# Altium schematic sheet DDR3.SchDoc
size C
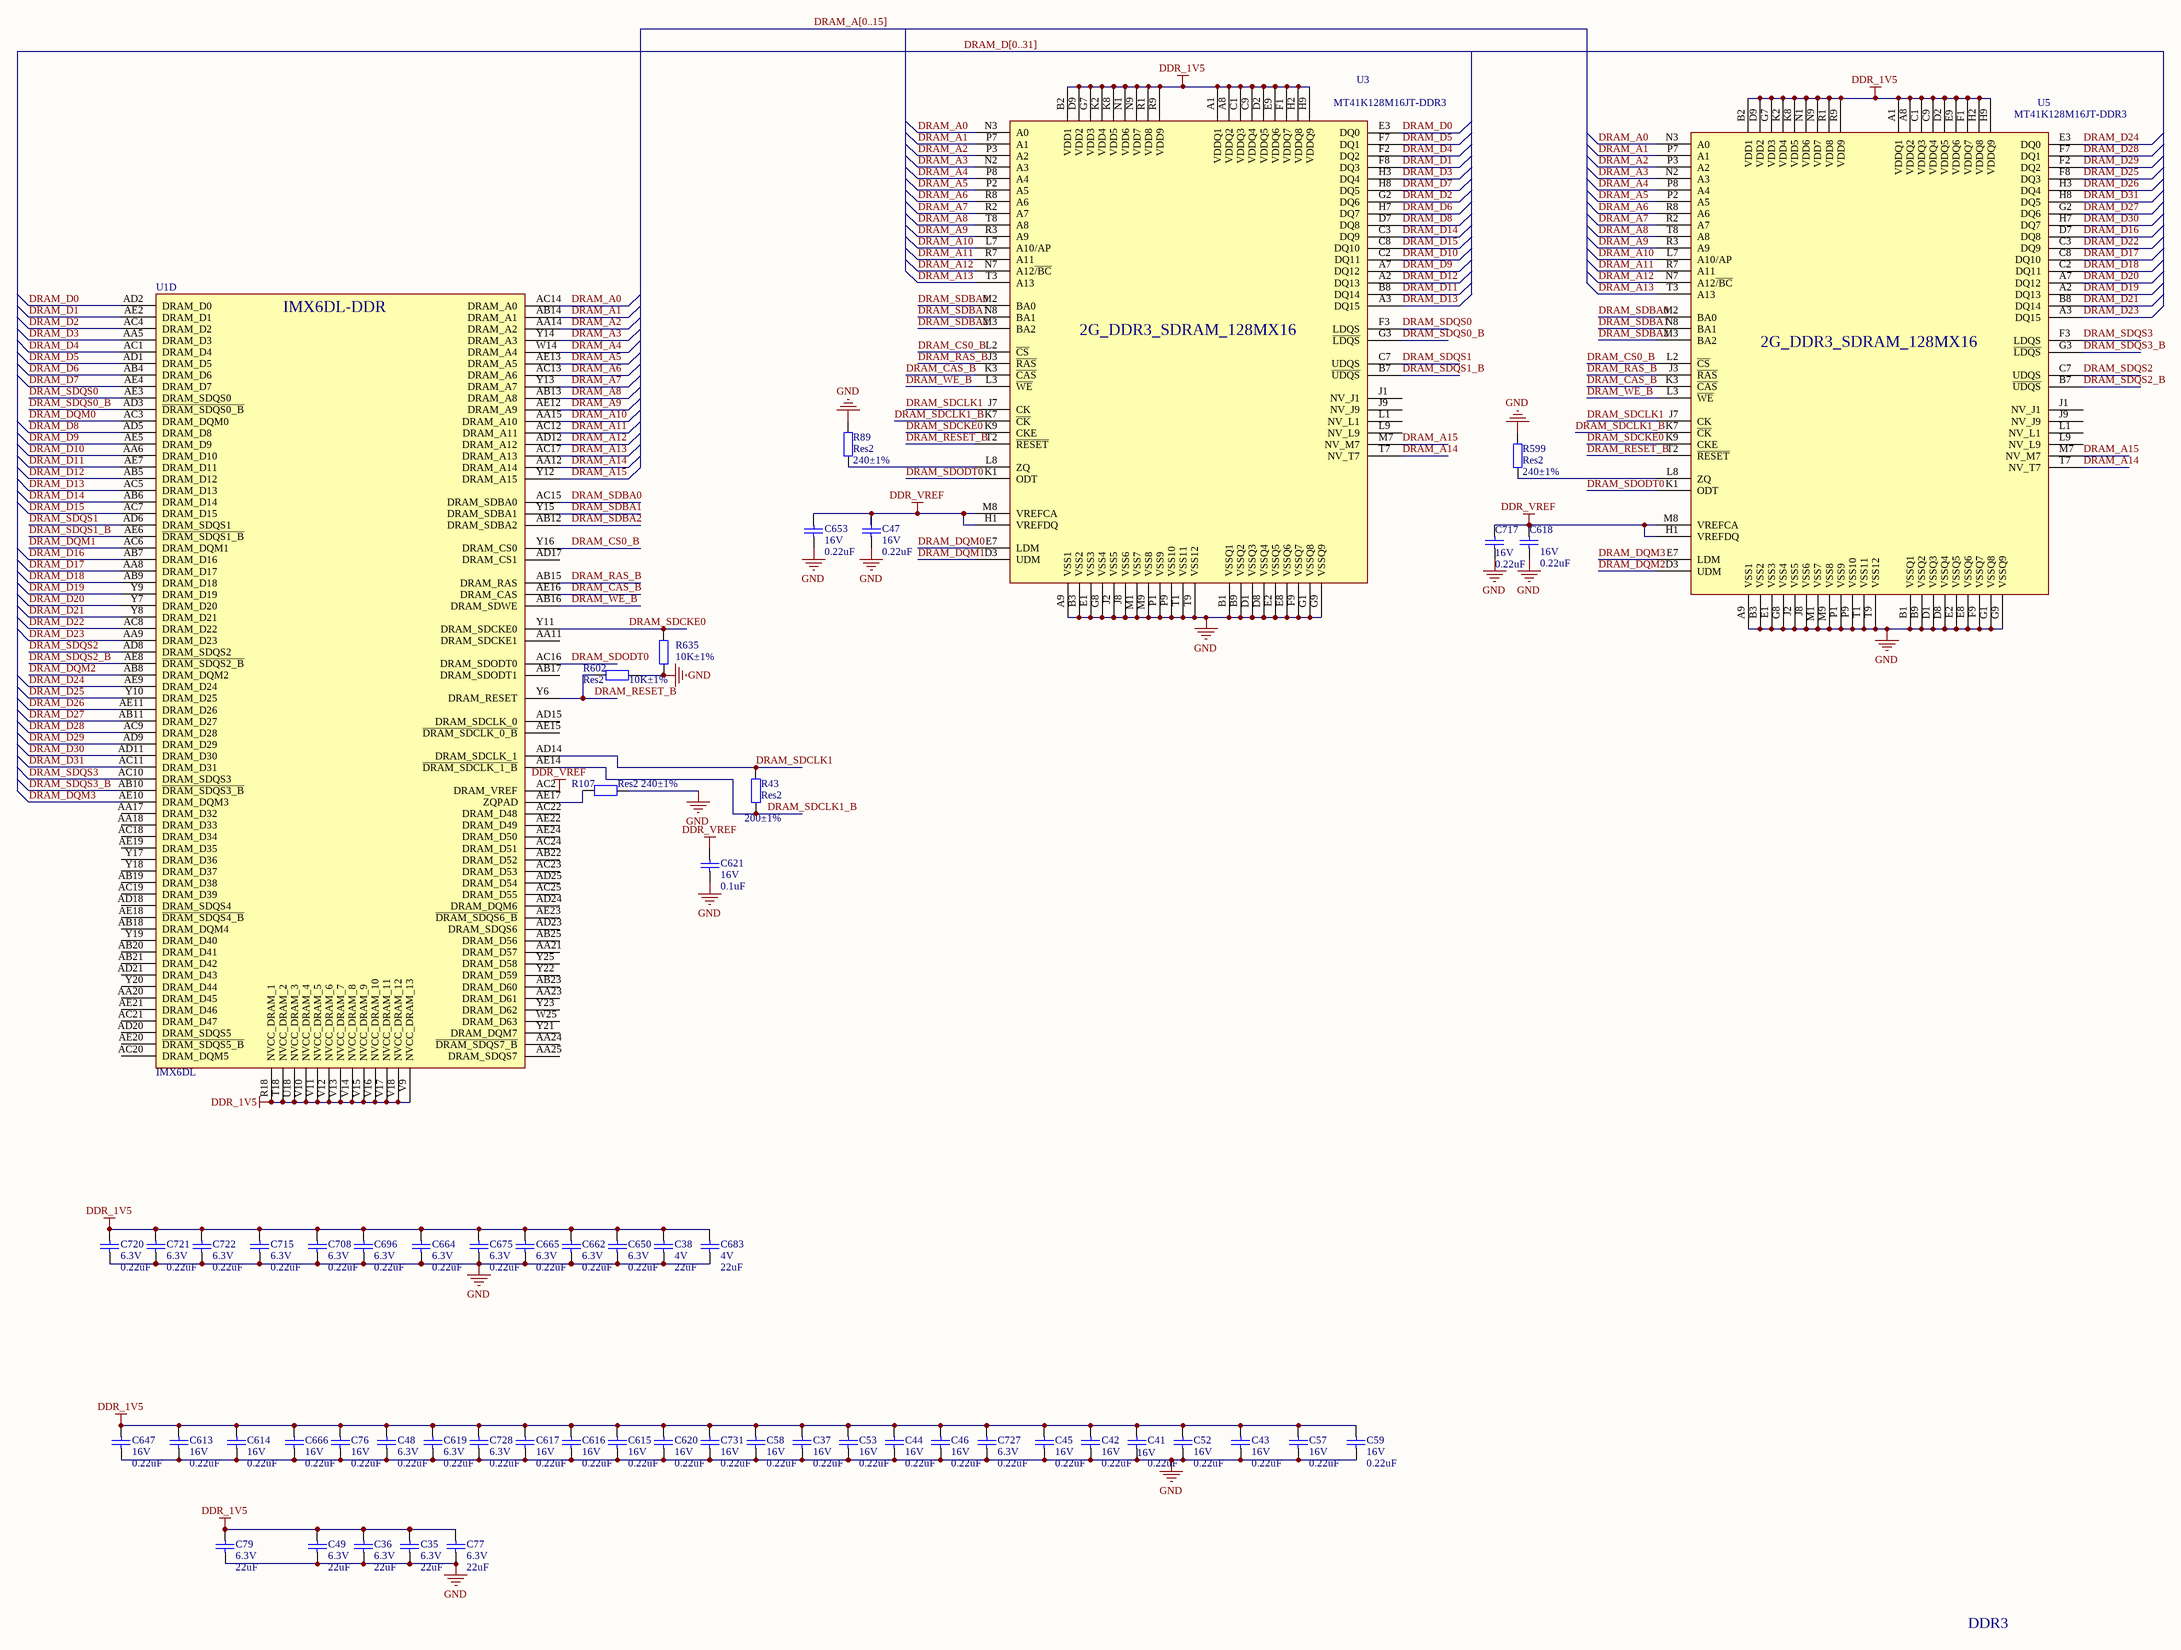
[diagram p0: DDR3.SchDoc]

## Parts
C35  6.3V  value 22uF  [0805]
C36  6.3V  value 22uF  [0805]
C37  16V  value 0.22uF  [0402]
C38  4V  value 22uF  [0603]
C41  16V  value 0.22uF  [0402]
C42  16V  value 0.22uF  [0402]
C43  16V  value 0.22uF  [0402]
C44  16V  value 0.22uF  [0402]
C45  16V  value 0.22uF  [0402]
C46  16V  value 0.22uF  [0402]
C47  16V  value 0.22uF  [0402]
C48  6.3V  value 0.22uF  [0201]
C49  6.3V  value 22uF  [0805]
C52  16V  value 0.22uF  [0402]
C53  16V  value 0.22uF  [0402]
C57  16V  value 0.22uF  [0402]
C58  16V  value 0.22uF  [0402]
C59  16V  value 0.22uF  [0402]
C76  16V  value 0.22uF  [0402]
C77  6.3V  value 22uF  [0805]
C79  6.3V  value 22uF  [0805]
C613  16V  value 0.22uF  [0402]
C614  16V  value 0.22uF  [0402]
C615  16V  value 0.22uF  [0402]
C616  16V  value 0.22uF  [0402]
C617  16V  value 0.22uF  [0402]
C618  16V  value 0.22uF  [0402]
C619  6.3V  value 0.22uF  [0201]
C620  16V  value 0.22uF  [0402]
C621  16V  value 0.1uF  [0402]
C647  16V  value 0.22uF  [0402]
C650  6.3V  value 0.22uF  [0201]
C653  16V  value 0.22uF  [0402]
C662  6.3V  value 0.22uF  [0201]
C664  6.3V  value 0.22uF  [0201]
C665  6.3V  value 0.22uF  [0201]
C666  16V  value 0.22uF  [0402]
C675  6.3V  value 0.22uF  [0201]
C683  4V  value 22uF  [0603]
C696  6.3V  value 0.22uF  [0201]
C708  6.3V  value 0.22uF  [0201]
C715  6.3V  value 0.22uF  [0201]
C717  16V  value 0.22uF  [0402]
C720  6.3V  value 0.22uF  [0201]
C721  6.3V  value 0.22uF  [0201]
C722  6.3V  value 0.22uF  [0201]
C727  6.3V  value 0.22uF  [0201]
C728  6.3V  value 0.22uF  [0201]
C731  16V  value 0.22uF  [0402]
R43  Res2  value 200±1%  [0402]
R89  Res2  value 240±1%  [0402]
R107  Res2  value 240±1%  [0402]
R599  Res2  value 240±1%  [0402]
R602  Res2  value 10K±1%  [0402]
R635  value 10K±1%  [0402]  (hidden comment: Res2)
U1  IMX6DL  [IMX6DL-BGA624x25]  (part D of 8)
U3  MT41K128M16JT-DDR3  [MT41K128M16JT-BGA96]
U5  MT41K128M16JT-DDR3  [MT41K128M16JT-BGA96]

## Nets
DDR_1V5: C35.2 C36.2 C37.2 C38.2 C41.2 C42.2 C43.2 C44.2 C45.2 C46.2 C48.2 C49.2 C52.2 C53.2 C57.2 C58.2 C59.2 C76.2 C77.2 C79.2 C613.2 C614.2 C615.2 C616.2 C617.2 C619.2 C620.2 C647.2 C650.2 C662.2 C664.2 C665.2 C666.2 C675.2 C683.2 C696.2 C708.2 C715.2 C720.2 C721.2 C722.2 C727.2 C728.2 C731.2 U1.R18(NVCC_DRAM_1) U1.T18(NVCC_DRAM_2) U1.U18(NVCC_DRAM_3) U1.V9(NVCC_DRAM_13) U1.V10(NVCC_DRAM_4) U1.V11(NVCC_DRAM_5) U1.V12(NVCC_DRAM_6) U1.V13(NVCC_DRAM_7) U1.V14(NVCC_DRAM_8) U1.V15(NVCC_DRAM_9) U1.V16(NVCC_DRAM_10) U1.V17(NVCC_DRAM_11) U1.V18(NVCC_DRAM_12) U3.A1(VDDQ1) U3.A8(VDDQ2) U3.B2(VDD1) U3.C1(VDDQ3) U3.C9(VDDQ4) U3.D2(VDDQ5) U3.D9(VDD2) U3.E9(VDDQ6) U3.F1(VDDQ7) U3.G7(VDD3) U3.H2(VDDQ8) U3.H9(VDDQ9) U3.K2(VDD4) U3.K8(VDD5) U3.N1(VDD6) U3.N9(VDD7) U3.R1(VDD8) U3.R9(VDD9) U5.A1(VDDQ1) U5.A8(VDDQ2) U5.B2(VDD1) U5.C1(VDDQ3) U5.C9(VDDQ4) U5.D2(VDDQ5) U5.D9(VDD2) U5.E9(VDDQ6) U5.F1(VDDQ7) U5.G7(VDD3) U5.H2(VDDQ8) U5.H9(VDDQ9) U5.K2(VDD4) U5.K8(VDD5) U5.N1(VDD6) U5.N9(VDD7) U5.R1(VDD8) U5.R9(VDD9)
DDR_VREF: C47.2 C618.2 C621.2 C653.2 C717.2 U1.AC2(DRAM_VREF) U3.H1(VREFDQ) U3.M8(VREFCA) U5.H1(VREFDQ) U5.M8(VREFCA)
GND: C35.1 C36.1 C37.1 C38.1 C41.1 C42.1 C43.1 C44.1 C45.1 C46.1 C47.1 C48.1 C49.1 C52.1 C53.1 C57.1 C58.1 C59.1 C76.1 C77.1 C79.1 C613.1 C614.1 C615.1 C616.1 C617.1 C618.1 C619.1 C620.1 C621.1 C647.1 C650.1 C653.1 C662.1 C664.1 C665.1 C666.1 C675.1 C683.1 C696.1 C708.1 C715.1 C717.1 C720.1 C721.1 C722.1 C727.1 C728.1 C731.1 R89.1 R107.1 R599.1 R602.1 R635.1 U3.A9(VSS1) U3.B1(VSSQ1) U3.B3(VSS2) U3.B9(VSSQ2) U3.D1(VSSQ3) U3.D8(VSSQ4) U3.E1(VSS3) U3.E2(VSSQ5) U3.E8(VSSQ6) U3.F9(VSSQ7) U3.G1(VSSQ8) U3.G8(VSS4) U3.G9(VSSQ9) U3.J2(VSS5) U3.J8(VSS6) U3.M1(VSS7) U3.M9(VSS8) U3.P1(VSS9) U3.P9(VSS10) U3.T1(VSS11) U3.T9(VSS12) U5.A9(VSS1) U5.B1(VSSQ1) U5.B3(VSS2) U5.B9(VSSQ2) U5.D1(VSSQ3) U5.D8(VSSQ4) U5.E1(VSS3) U5.E2(VSSQ5) U5.E8(VSSQ6) U5.F9(VSSQ7) U5.G1(VSSQ8) U5.G8(VSS4) U5.G9(VSSQ9) U5.J2(VSS5) U5.J8(VSS6) U5.M1(VSS7) U5.M9(VSS8) U5.P1(VSS9) U5.P9(VSS10) U5.T1(VSS11) U5.T9(VSS12)
DRAM_A0: U1.AC14(DRAM_A0) U3.N3(A0) U5.N3(A0)
DRAM_A1: U1.AB14(DRAM_A1) U3.P7(A1) U5.P7(A1)
DRAM_A2: U1.AA14(DRAM_A2) U3.P3(A2) U5.P3(A2)
DRAM_A3: U1.Y14(DRAM_A3) U3.N2(A3) U5.N2(A3)
DRAM_A4: U1.W14(DRAM_A4) U3.P8(A4) U5.P8(A4)
DRAM_A5: U1.AE13(DRAM_A5) U3.P2(A5) U5.P2(A5)
DRAM_A6: U1.AC13(DRAM_A6) U3.R8(A6) U5.R8(A6)
DRAM_A7: U1.Y13(DRAM_A7) U3.R2(A7) U5.R2(A7)
DRAM_A8: U1.AB13(DRAM_A8) U3.T8(A8) U5.T8(A8)
DRAM_A9: U1.AE12(DRAM_A9) U3.R3(A9) U5.R3(A9)
DRAM_A10: U1.AA15(DRAM_A10) U3.L7(A10/AP) U5.L7(A10/AP)
DRAM_A11: U1.AC12(DRAM_A11) U3.R7(A11) U5.R7(A11)
DRAM_A12: U1.AD12(DRAM_A12) U3.N7(A12~{/BC}) U5.N7(A12~{/BC})
DRAM_A13: U1.AC17(DRAM_A13) U3.T3(A13) U5.T3(A13)
DRAM_A14: U1.AA12(DRAM_A14) U3.T7(NV_T7) U5.T7(NV_T7)
DRAM_A15: U1.Y12(DRAM_A15) U3.M7(NV_M7) U5.M7(NV_M7)
DRAM_CAS_B: U1.AE16(DRAM_CAS) U3.K3(~{CAS}) U5.K3(~{CAS})
DRAM_CS0_B: U1.Y16(DRAM_CS0) U3.L2(~{CS}) U5.L2(~{CS})
DRAM_D0: U1.AD2(DRAM_D0) U3.E3(DQ0)
DRAM_D1: U1.AE2(DRAM_D1) U3.F8(DQ3)
DRAM_D2: U1.AC4(DRAM_D2) U3.G2(DQ6)
DRAM_D3: U1.AA5(DRAM_D3) U3.H3(DQ4)
DRAM_D4: U1.AC1(DRAM_D4) U3.F2(DQ2)
DRAM_D5: U1.AD1(DRAM_D5) U3.F7(DQ1)
DRAM_D6: U1.AB4(DRAM_D6) U3.H7(DQ7)
DRAM_D7: U1.AE4(DRAM_D7) U3.H8(DQ5)
DRAM_D8: U1.AD5(DRAM_D8) U3.D7(DQ8)
DRAM_D9: U1.AE5(DRAM_D9) U3.A7(DQ12)
DRAM_D10: U1.AA6(DRAM_D10) U3.C2(DQ11)
DRAM_D11: U1.AE7(DRAM_D11) U3.B8(DQ14)
DRAM_D12: U1.AB5(DRAM_D12) U3.A2(DQ13)
DRAM_D13: U1.AC5(DRAM_D13) U3.A3(DQ15)
DRAM_D14: U1.AB6(DRAM_D14) U3.C3(DQ9)
DRAM_D15: U1.AC7(DRAM_D15) U3.C8(DQ10)
DRAM_D16: U1.AB7(DRAM_D16) U5.D7(DQ8)
DRAM_D17: U1.AA8(DRAM_D17) U5.C8(DQ10)
DRAM_D18: U1.AB9(DRAM_D18) U5.C2(DQ11)
DRAM_D19: U1.Y9(DRAM_D19) U5.A2(DQ13)
DRAM_D20: U1.Y7(DRAM_D20) U5.A7(DQ12)
DRAM_D21: U1.Y8(DRAM_D21) U5.B8(DQ14)
DRAM_D22: U1.AC8(DRAM_D22) U5.C3(DQ9)
DRAM_D23: U1.AA9(DRAM_D23) U5.A3(DQ15)
DRAM_D24: U1.AE9(DRAM_D24) U5.E3(DQ0)
DRAM_D25: U1.Y10(DRAM_D25) U5.F8(DQ3)
DRAM_D26: U1.AE11(DRAM_D26) U5.H3(DQ4)
DRAM_D27: U1.AB11(DRAM_D27) U5.G2(DQ6)
DRAM_D28: U1.AC9(DRAM_D28) U5.F7(DQ1)
DRAM_D29: U1.AD9(DRAM_D29) U5.F2(DQ2)
DRAM_D30: U1.AD11(DRAM_D30) U5.H7(DQ7)
DRAM_D31: U1.AC11(DRAM_D31) U5.H8(DQ5)
DRAM_DQM0: U1.AC3(DRAM_DQM0) U3.E7(LDM)
DRAM_DQM1: U1.AC6(DRAM_DQM1) U3.D3(UDM)
DRAM_DQM2: U1.AB8(DRAM_DQM2) U5.D3(UDM)
DRAM_DQM3: U1.AE10(DRAM_DQM3) U5.E7(LDM)
DRAM_RAS_B: U1.AB15(DRAM_RAS) U3.J3(~{RAS}) U5.J3(~{RAS})
DRAM_RESET_B: R602.2 U1.Y6(DRAM_RESET) U3.T2(~{RESET}) U5.T2(~{RESET})
DRAM_SDBA0: U1.AC15(DRAM_SDBA0) U3.M2(BA0) U5.M2(BA0)
DRAM_SDBA1: U1.Y15(DRAM_SDBA1) U3.N8(BA1) U5.N8(BA1)
DRAM_SDBA2: U1.AB12(DRAM_SDBA2) U3.M3(BA2) U5.M3(BA2)
DRAM_SDCKE0: R635.2 U1.Y11(DRAM_SDCKE0) U3.K9(CKE) U5.K9(CKE)
DRAM_SDCLK1: R43.2 U1.AD14(DRAM_SDCLK_1) U3.J7(CK) U5.J7(CK)
DRAM_SDCLK1_B: R43.1 U1.AE14(~{DRAM_SDCLK_1_B}) U3.K7(~{CK}) U5.K7(~{CK})
DRAM_SDODT0: U1.AC16(DRAM_SDODT0) U3.K1(ODT) U5.K1(ODT)
DRAM_SDQS0: U1.AE3(DRAM_SDQS0) U3.F3(LDQS)
DRAM_SDQS0_B: U1.AD3(~{DRAM_SDQS0_B}) U3.G3(~{LDQS})
DRAM_SDQS1: U1.AD6(DRAM_SDQS1) U3.C7(UDQS)
DRAM_SDQS1_B: U1.AE6(~{DRAM_SDQS1_B}) U3.B7(~{UDQS})
DRAM_SDQS2: U1.AD8(DRAM_SDQS2) U5.C7(UDQS)
DRAM_SDQS2_B: U1.AE8(~{DRAM_SDQS2_B}) U5.B7(~{UDQS})
DRAM_SDQS3: U1.AC10(DRAM_SDQS3) U5.F3(LDQS)
DRAM_SDQS3_B: U1.AB10(~{DRAM_SDQS3_B}) U5.G3(~{LDQS})
DRAM_WE_B: U1.AB16(DRAM_SDWE) U3.L3(~{WE}) U5.L3(~{WE})
NetR89_2: R89.2 U3.L8(ZQ)
NetR107_2: R107.2 U1.AE17(ZQPAD)
NetR599_2: R599.2 U5.L8(ZQ)

Not connected (* = marked no-connect by the designer): U1 AA11(DRAM_SDCKE1) AA17(DRAM_D32) AA18(DRAM_D33) AA20(DRAM_D45) AA21(DRAM_D57) AA23(DRAM_D61) AA24(~{DRAM_SDQS7_B}) AA25(DRAM_SDQS7) AB17(DRAM_SDODT1) AB18(DRAM_DQM4) AB19(DRAM_D38) AB20(DRAM_D41) AB21(DRAM_D42) AB22(DRAM_D52) AB23(DRAM_D60) AB25(DRAM_D56) AC18(DRAM_D34) AC19(DRAM_D39) AC20(DRAM_DQM5) AC21(DRAM_D47) AC22(DRAM_D48) AC23(DRAM_D53) AC24(DRAM_D51) AC25(DRAM_D55) AD15(DRAM_SDCLK_0) AD17(DRAM_CS1) AD18(DRAM_SDQS4) AD20(DRAM_SDQS5) AD21(DRAM_D43) AD23(DRAM_SDQS6) AD24(DRAM_DQM6) AD25(DRAM_D54) AE15(~{DRAM_SDCLK_0_B}) AE18(~{DRAM_SDQS4_B}) AE19(DRAM_D35) AE20(~{DRAM_SDQS5_B}) AE21(DRAM_D46) AE22(DRAM_D49) AE23(~{DRAM_SDQS6_B}) AE24(DRAM_D50) W25(DRAM_D63) Y17(DRAM_D36) Y18(DRAM_D37) Y19(DRAM_D40) Y20(DRAM_D44) Y21(DRAM_DQM7) Y22(DRAM_D59) Y23(DRAM_D62) Y25(DRAM_D58); U3 J1(NV_J1) J9(NV_J9) L1(NV_L1) L9(NV_L9); U5 J1(NV_J1) J9(NV_J9) L1(NV_L1) L9(NV_L9)

## Buses and harness runs
bus DRAM_A[0..15]
bus DRAM_D[0..31]

## Notes on the sheet
- DDR3
- (in symbol IMX6DL, part D) IMX6DL-DDR
- (in symbol MT41K128M16JT-DDR3) 2G_DDR3_SDRAM_128MX16

## Library data of the parts
C35-C38 C41-C49 C52 C53 C57-C59 C76 C77 C79 C613-C621 C647 C650 C653 C662 C664-C666 C675 C683 C696 C708 C715 C717 C720-C722 C727 C728 C731 = Cap: Capacitor; Published: 8-Jun-2000; LatestRevisionDate: 17-Jul-2002; LatestRevisionNote: Re-released for DXP Platform.; PackageReference: RAD-0.3; Publisher: Altium Limited
R43 R89 R107 R599 R602 R635 = Res2: Resistor; Published: 8-Jun-2000; LatestRevisionDate: 17-Jul-2002; LatestRevisionNote: Re-released for DXP Platform.; PackageReference: AXIAL-0.4; Publisher: Altium Limited